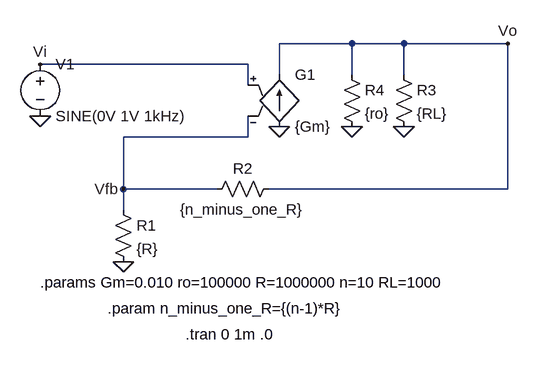
[diagram p0: schematic tut1ques3c.asc]
tut1ques3c.asc, the LTspice schematic file:
Version 4
SHEET 1 880 680
WIRE 96 -128 -16 -128
WIRE 176 -128 96 -128
WIRE 336 -128 176 -128
WIRE -64 -96 -384 -96
WIRE -16 -80 -16 -128
WIRE 96 -80 96 -128
WIRE 176 -80 176 -128
WIRE -64 -64 -64 -96
WIRE -64 16 -64 -16
WIRE -64 16 -256 16
WIRE -256 96 -256 16
WIRE -112 96 -256 96
WIRE 336 96 336 -128
WIRE 336 96 -32 96
WIRE -256 128 -256 96
FLAG -16 0 0
FLAG 96 0 0
FLAG -384 -16 0
FLAG -256 208 0
FLAG -384 -96 Vi
FLAG 336 -128 Vo
FLAG -256 96 Vfb
FLAG 176 0 0
SYMBOL res 80 -96 R0
SYMATTR InstName R4
SYMATTR Value {ro}
SYMBOL voltage -384 -112 R0
SYMATTR InstName V1
SYMATTR Value SINE(0V 1V 1kHz)
SYMBOL g -16 -96 R0
SYMATTR InstName G1
SYMATTR Value {Gm}
SYMBOL res -272 112 R0
SYMATTR InstName R1
SYMATTR Value {R}
SYMBOL res -16 80 R90
WINDOW 0 0 56 VBottom 2
WINDOW 3 32 56 VTop 2
SYMATTR InstName R2
SYMATTR Value {n_minus_one_R}
SYMBOL res 160 -96 R0
SYMATTR InstName R3
SYMATTR Value {RL}
TEXT -384 240 Left 2 !.params Gm=0.010 ro=100000 R=1000000 n=10 RL=1000
TEXT -160 320 Left 2 !.tran 0 1m .0
TEXT -280 280 Left 2 !.param n_minus_one_R={(n-1)*R}

The netlist it stands for:
* tut1ques3c.asc
R4 Vo 0 {ro}
V1 Vi 0 SINE(0V 1V 1kHz)
G1 0 Vo Vi Vfb {Gm}
R1 Vfb 0 {R}
R2 Vo Vfb {n_minus_one_R}
R3 Vo 0 {RL}
.params Gm=0.010 ro=100000 R=1000000 n=10 RL=1000
.tran 0 1m .0
.param n_minus_one_R={(n-1)*R}
.backanno
.end